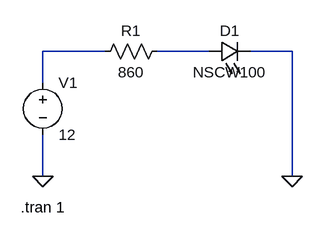
[diagram p0: schematic led-circuit-01.asc]
led-circuit-01.asc, the LTspice schematic file:
Version 4
SHEET 1 880 680
WIRE 224 96 128 96
WIRE 384 96 304 96
WIRE 512 96 448 96
WIRE 128 144 128 96
WIRE 128 288 128 224
WIRE 512 288 512 96
FLAG 128 288 0
FLAG 512 288 0
SYMBOL voltage 128 128 R0
WINDOW 123 0 0 Left 0
WINDOW 39 0 0 Left 0
SYMATTR InstName V1
SYMATTR Value 12
SYMBOL res 208 112 R270
WINDOW 0 32 56 VTop 2
WINDOW 3 0 56 VBottom 2
SYMATTR InstName R1
SYMATTR Value 860
SYMBOL LED 384 112 R270
WINDOW 0 32 32 VTop 2
WINDOW 3 0 32 VBottom 2
SYMATTR InstName D1
SYMATTR Value NSCW100
SYMATTR Description Diode
SYMATTR Type diode
TEXT 94 336 Left 2 !.tran 1

The netlist it stands for:
* led-circuit-01.asc
V1 N001 0 12
R1 N001 N002 860
D1 N002 0 NSCW100
.model D D
.lib standard.dio
.tran 1
.backanno
.end